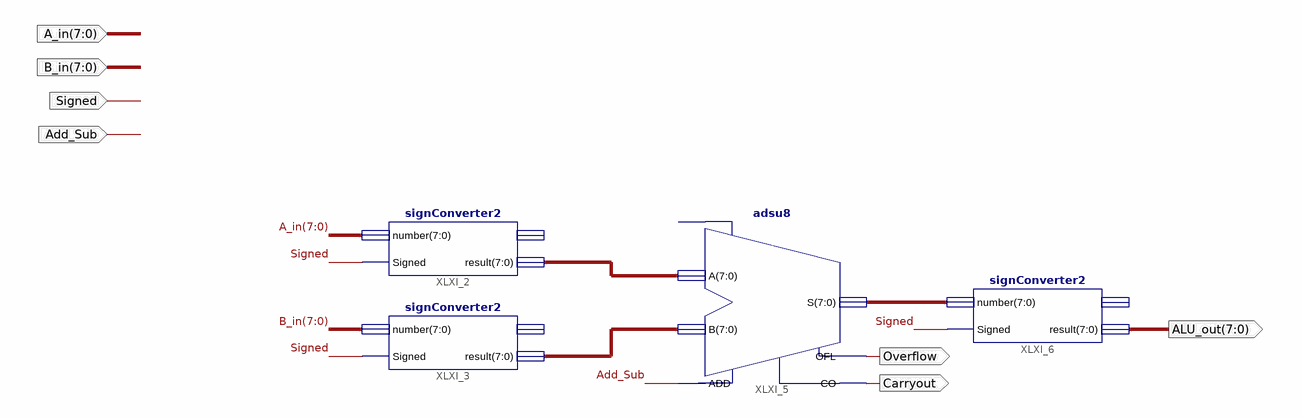
[diagram p0: schematic sheet 1]
// Xilinx ISE schematic ALU_component.sch (spartan3e) as structural Verilog: 4 symbols, 7 ports
module ALU_component (
  input  [7:0] A_in,
  input  [7:0] B_in,
  input  Signed,
  input  Add_Sub,
  output [7:0] ALU_out,
  output Overflow,
  output Carryout
);

  wire [7:0] XLXN_11, XLXN_12, XLXN_14;

  signConverter2 XLXI_2 (.number(A_in), .Signed(Signed), .result(XLXN_11));  // open: compliment
  signConverter2 XLXI_3 (.number(B_in), .Signed(Signed), .result(XLXN_12));  // open: compliment
  adsu8 XLXI_5 (.A(XLXN_11), .ADD(Add_Sub), .B(XLXN_12), .CO(Carryout), .OFL(Overflow), .S(XLXN_14));  // open: CI
  signConverter2 XLXI_6 (.number(XLXN_14), .Signed(Signed), .result(ALU_out));  // open: compliment
endmodule
